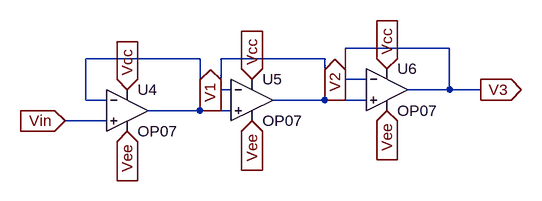
[diagram p0: schematic splitter3.asc]
splitter3.asc, the LTspice schematic file:
Version 4
SHEET 1 1272 680
WIRE 1136 -80 976 -80
WIRE 752 -64 576 -64
WIRE 944 -64 784 -64
WIRE 976 -32 976 -80
WIRE 1008 -32 976 -32
WIRE 784 -16 784 -64
WIRE 800 -16 784 -16
WIRE 1136 -16 1136 -80
WIRE 1136 -16 1072 -16
WIRE 1184 -16 1136 -16
WIRE 576 0 576 -64
WIRE 608 0 576 0
WIRE 944 0 944 -64
WIRE 944 0 864 0
WIRE 960 0 944 0
WIRE 1008 0 960 0
WIRE 752 16 752 -64
WIRE 752 16 672 16
WIRE 768 16 752 16
WIRE 800 16 768 16
WIRE 608 32 544 32
FLAG 544 32 Vin
IOPIN 544 32 In
FLAG 640 -16 Vcc
IOPIN 640 -16 In
FLAG 832 -32 Vcc
IOPIN 832 -32 In
FLAG 1040 -48 Vcc
IOPIN 1040 -48 In
FLAG 640 48 Vee
IOPIN 640 48 In
FLAG 832 32 Vee
IOPIN 832 32 In
FLAG 1040 16 Vee
IOPIN 1040 16 In
FLAG 768 16 V1
IOPIN 768 16 Out
FLAG 960 0 V2
IOPIN 960 0 Out
FLAG 1184 -16 V3
IOPIN 1184 -16 Out
SYMBOL OpAmps\\OP07 640 -48 R0
SYMATTR InstName U4
SYMBOL OpAmps\\OP07 832 -64 R0
SYMATTR InstName U5
SYMBOL OpAmps\\OP07 1040 -80 R0
SYMATTR InstName U6

The netlist it stands for:
* splitter3.asc
XU4 Vin V1 Vcc Vee V1 LT1001  ; OP07, pins In+ In- V+ V- OUT
XU5 V1 V2 Vcc Vee V2 LT1001  ; OP07, pins In+ In- V+ V- OUT
XU6 V2 V3 Vcc Vee V3 LT1001  ; OP07, pins In+ In- V+ V- OUT
.lib LTC.lib
.backanno
.end